# EAGLE schematic Arduino Wheel Schematic (EAGLE 8.6.3)
This is a Schematic Design of my entire Arduino Wheel. Its made up of an Arduino, RC controller, and Basic Components.
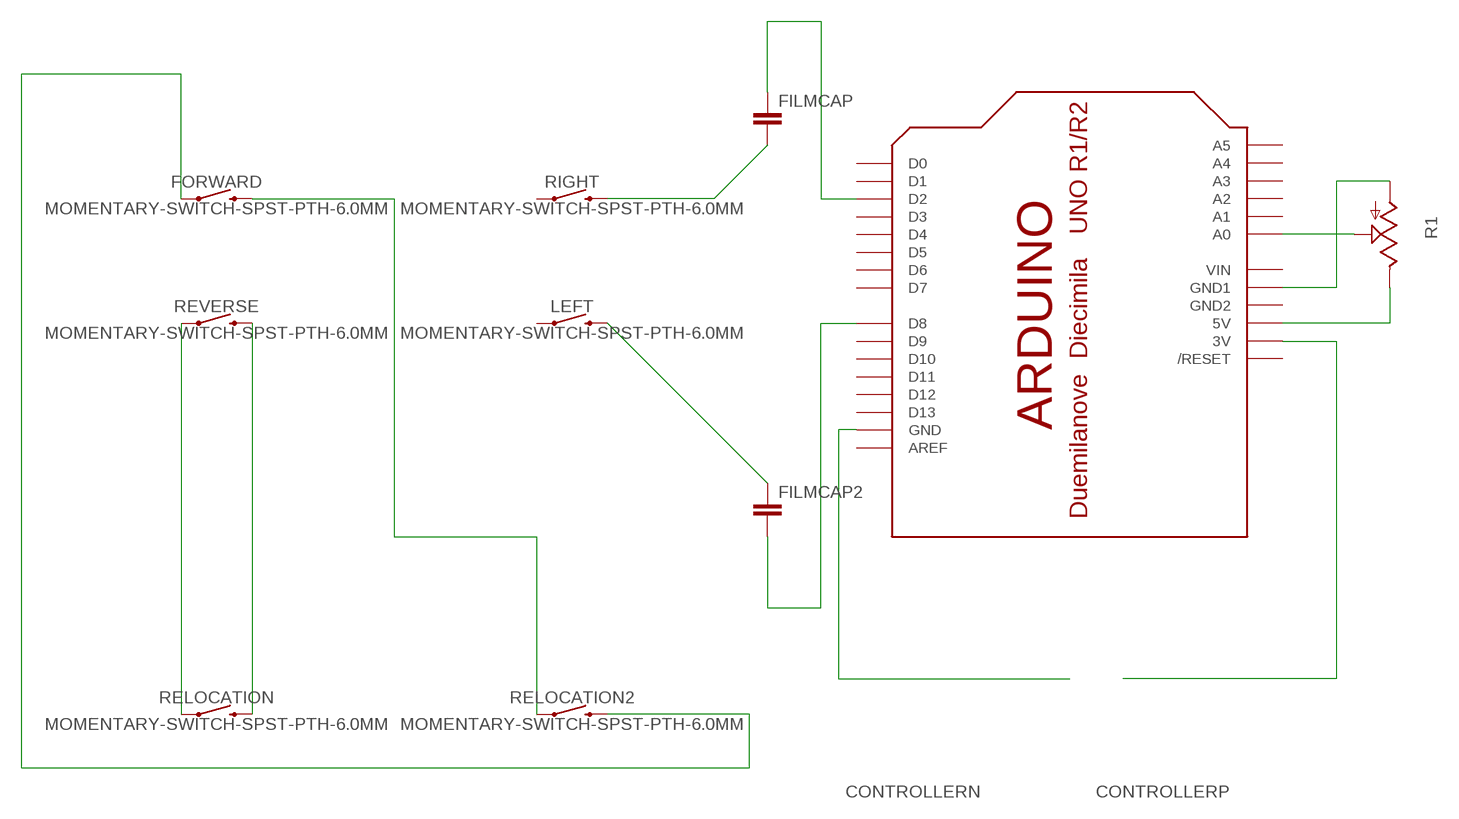
[diagram p0: schematic, sheet 1]

## Parts
FILMCAP  C-EU025-025X050  [C025-025X050]
FILMCAP2  C-EU025-025X050  [C025-025X050]
FORWARD  MOMENTARY-SWITCH-SPST-PTH-6.0MM  [TACTILE_SWITCH_PTH_6.0MM]
LEFT  MOMENTARY-SWITCH-SPST-PTH-6.0MM  [TACTILE_SWITCH_PTH_6.0MM]
R1  TRIM_US-3223G  [3223G]
RELOCATION  MOMENTARY-SWITCH-SPST-PTH-6.0MM  [TACTILE_SWITCH_PTH_6.0MM]
RELOCATION2  MOMENTARY-SWITCH-SPST-PTH-6.0MM  [TACTILE_SWITCH_PTH_6.0MM]
REVERSE  MOMENTARY-SWITCH-SPST-PTH-6.0MM  [TACTILE_SWITCH_PTH_6.0MM]
RIGHT  MOMENTARY-SWITCH-SPST-PTH-6.0MM  [TACTILE_SWITCH_PTH_6.0MM]
U$2  ARDUINO-NOHOLE  [ARDUINO-NOHOLE]

## Nets
CONTROLLERN: U$2.GND
CONTROLLERP: U$2.3V
N$1: FILMCAP2.2 U$2.D8
N$2: FILMCAP.1 U$2.D2
N$3: FILMCAP.2 RIGHT.3
N$4: FILMCAP2.1 LEFT.3
N$5: FORWARD.3 RELOCATION2.1
N$6: FORWARD.1 RELOCATION2.3
N$7: RELOCATION.3 REVERSE.3
N$8: RELOCATION.1 REVERSE.1
N$9: R1.3(E) U$2.5V
N$10: R1.2(S) U$2.A0
N$11: R1.1(A) U$2.GND1
Unconnected: LEFT.1 RIGHT.1 U$2.A1 U$2.A2 U$2.A3 U$2.A4 U$2.A5 U$2.AREF U$2.D0 U$2.D1 U$2.D3 U$2.D4 U$2.D5 U$2.D6 U$2.D7 U$2.D9 U$2.D10 U$2.D11 U$2.D12 U$2.D13 U$2.RESET(/RESET)

## Power pins joined to a net without a drawn wire
GND2: U$2.GND2
VIN: U$2.VIN

## Library data of the parts
FILMCAP FILMCAP2 = resistor:C-EU: CAPACITOR, European symbol
FORWARD LEFT RELOCATION RELOCATION2 REVERSE RIGHT = SparkFun-Switches:MOMENTARY-SWITCH-SPST: Momentary Switch (Pushbutton) - SPST Normally-open (NO) SPST momentary switches (buttons, pushbuttons). Variants PTH-12MM - 12mm square, through-hole Momentary Pushbutton Switch - 12mm Square <https://www.sparkfun.com/products/9190> (COM-09190) PTH-6.0MM, PTH-6.0MM-KIT - 6.0mm square, through-hole Mini Pushbutton Switch <https://www.sparkfun.com/products/97> (COM-00097) KIT package intended for soldering kit's - only one side of pads' copper is exposed. PTH-RIGHT-ANGLE-KIT - Right-angle, through-hole Right Angle Tactile Button <https://www.sparkfun.com/products/10791> - Used on SparkFun BigTime Watch Kit <https://www.sparkfun.com/products/11734> SMD-12MM - 12mm square, surface-mount Tactile Button - SMD (12mm) <https://www.sparkfun.com/products/12993> (COM-12993) Used on SparkFun PicoBoard <https://www.sparkfun.com/products/11888> SMD-4.5MM - 4.5mm Square Trackball Switch Used on SparkFun Blackberry Trackballer Breakout <https://www.sparkfun.com/products/13169> SMD-4.6MMX2.8MM - 4.60mm x 2.80mm, surface mount Used on SparkFun SAMD21 Mini Breakout <https://www.sparkfun.com/products/13664> SMD-5.2MM, SMD-5.2-REDUNDANT - 5.2mm square, surface-mount Mini Pushbutton Switch - SMD <https://www.sparkfun.com/products/8720> (COM-08720) Used on Arduino Pro Mini <https://www.sparkfun.com/products/11114> REDUNDANT package connects both switch circuits together SMD-6.0X3.5MM - 6.0 x 3.5mm, surface mount Momentary Reset Switch SMD <https://www.sparkfun.com/products/8229> (COM-08229) SMD-6.2MM-TALL - 6.2mm square, surface mount Tactile Button - SMD (6mm) <https://www.sparkfun.com/products/12992> Used on SparkFun Digital Sandbox <https://www.sparkfun.com/products/12651> SMD-RIGHT-ANGLE - Right-angle, surface mount Used on SparkFun Block for Intel® Edison - Arduino <https://www.sparkfun.com/products/13036>; PROD_ID: SWCH-08441; SF_SKU: COM-00097
R1 = pot:TRIM_US-: POTENTIOMETER
U$2 = adafruit:ARDUINO: Arduino Diecimila/Duemilanove Make a shield with ease, this package has all the named pins as well as the two mounting drill holes and an outline of the USB and DC power connector. The outline is on the DIMENSION layer, so if your board house uses it they will cut the outline to match. http://www.ladyada.net/library/pcb/eaglelibrary.html

## Module CONTROLLER
Ports: 

### Library data of the parts